# Altium schematic sheet ModuleRegulator.SchDoc: Module Regulator
size A; DocumentNumber: 4; SheetNumber: 4; SheetTotal: 22
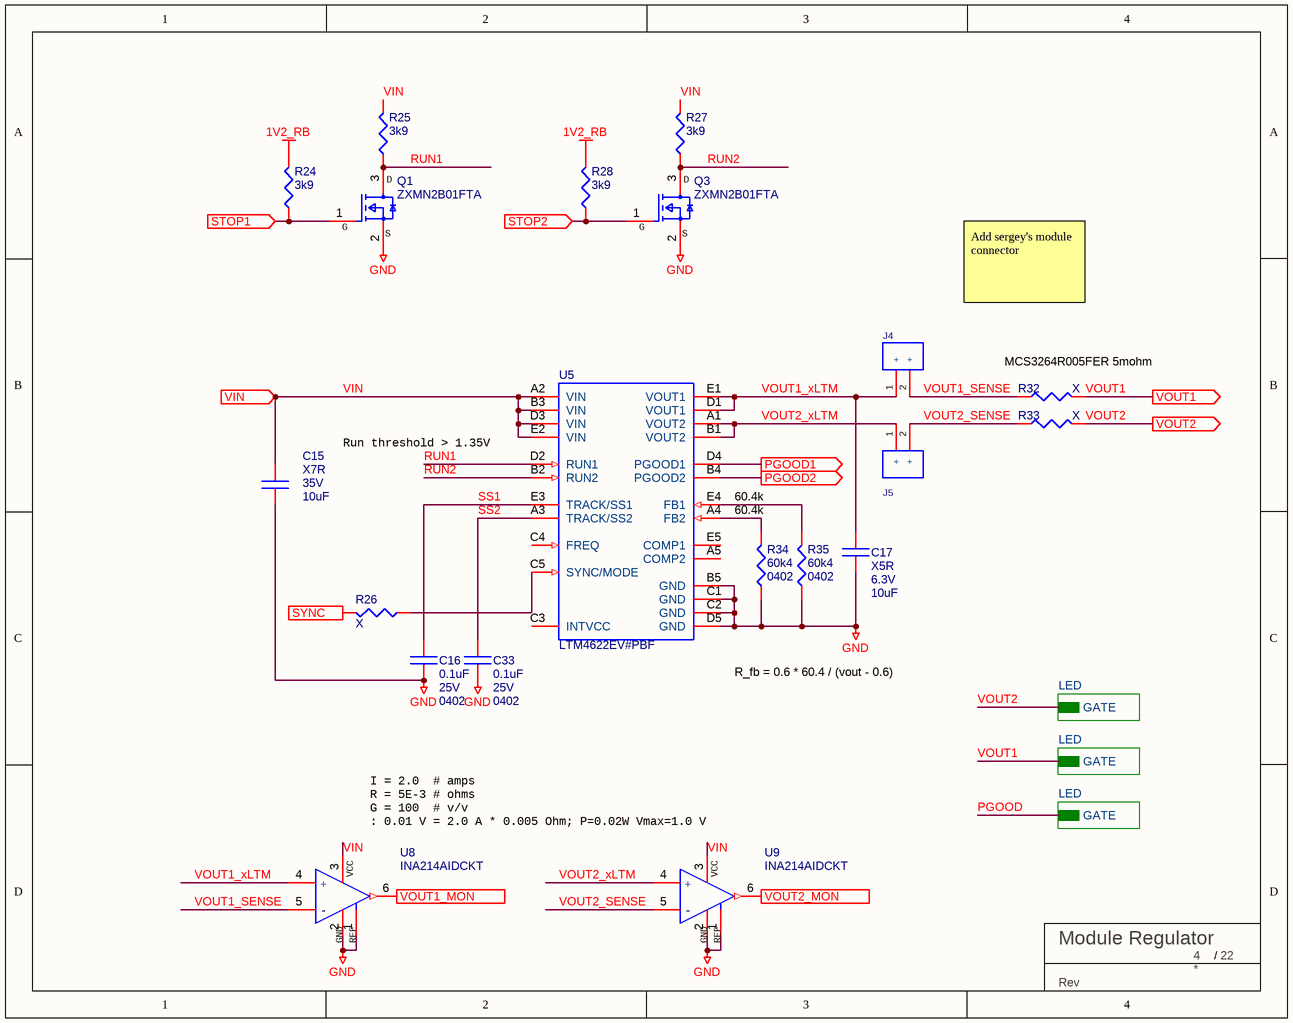
[diagram p0: ModuleRegulator.SchDoc]

## Parts
C15  TempCo: X7R  Voltage: 35V  [C_1206_IPC]  (hidden comment: 10uF)
C16  0.1uF  Voltage: 25V  Package: 0402  [C_0402_IPC_NOSILK]
C17  TempCo: X5R  Voltage: 6.3V  [C_0603_IPC]  (hidden comment: 10uF)
C33  0.1uF  Voltage: 25V  Package: 0402  [C_0402_IPC_NOSILK]
J4  HEADER 01x02  [HEADER 01x02]  (value not drawn)
J5  HEADER 01x02  [HEADER 01x02]  (value not drawn)
Q1  ZXMN2B01FTA  [SOT-23]
Q3  ZXMN2B01FTA  [SOT-23]
R24  3k9  [R_0402_IPC]
R25  3k9  [R_0402_IPC]
R26  Parameter 1: X  [resc1005n]  (hidden comment: ERJ-2GEJ201X)
R27  3k9  [R_0402_IPC]
R28  3k9  [R_0402_IPC]
R32  X  [resc1005n]
R33  X  [resc1005n]
R34  60k4  Package: 0402  [R_0402_IPC]
R35  60k4  Package: 0402  [R_0402_IPC]
TBLOCK?  BU Title block  (value not drawn)  (graphical)
U5  LTM4622EV#PBF  [LT-LGA-25-6250X6250X1820_V]
U8  INA214AIDCKT  [FP-DCK0006A-IPC_A]
U9  INA214AIDCKT  [FP-DCK0006A-IPC_A]

## Sub-sheets
LED = LED-Driver.SchDoc: GATE
LED = LED-Driver.SchDoc: GATE
LED = LED-Driver.SchDoc: GATE

## Ports
PGOOD1 (out), PGOOD2 (out), STOP1 (in), STOP2 (in), SYNC (in), VIN (in), VOUT1 (out), VOUT1_MON (out), VOUT2 (out), VOUT2_MON (out)

## Nets
1V2_RB: R24.2 R28.2
GND: C15.2 C16.1 C17.2 C33.1 Q1.2(Source) Q3.2(Source) R34.1 R35.1 U5.B5(GND) U5.C1(GND) U5.C2(GND) U5.D5(GND) U8.1(REF) U8.2(GND) U9.1(REF) U9.2(GND)
PGOOD: sheet LED/GATE
PGOOD1: U5.D4(PGOOD1) ; port PGOOD1
PGOOD2: U5.B4(PGOOD2) ; port PGOOD2
RUN1: Q1.3(Drain) R25.1 U5.D2(RUN1)
RUN2: Q3.3(Drain) R27.1 U5.B2(RUN2)
SS1: C16.2 U5.E3(TRACK/SS1)
SS2: C33.2 U5.A3(TRACK/SS2)
STOP1: Q1.1(Gate) R24.1 ; port STOP1
STOP2: Q3.1(Gate) R28.1 ; port STOP2
SYNC: R26.2 ; port SYNC
VIN: C15.1 R25.2 R27.2 U5.A2(VIN) U5.B3(VIN) U5.D3(VIN) U5.E2(VIN) U8.3(V+) U9.3(V+) ; port VIN
VOUT1: R32.2 ; port VOUT1, sheet LED/GATE
VOUT1_MON: U8.6(OUT) ; port VOUT1_MON
VOUT1_SENSE: J4.2(+) R32.1 U8.5(IN-)
VOUT1_xLTM: C17.1 J4.1(+) U5.D1(VOUT1) U5.E1(VOUT1) U8.4(IN+)
VOUT2: R33.2 ; port VOUT2, sheet LED/GATE
VOUT2_MON: U9.6(OUT) ; port VOUT2_MON
VOUT2_SENSE: J5.2(+) R33.1 U9.5(IN-)
VOUT2_xLTM: J5.1(+) U5.A1(VOUT2) U5.B1(VOUT2) U9.4(IN+)
NetR26_1: R26.1 U5.C5(SYNC/MODE)
NetR34_2: R34.2 U5.A4(FB2)
NetR35_2: R35.2 U5.E4(FB1)

Not connected (* = marked no-connect by the designer): U5 A5(COMP2) C3(INTVCC) C4(FREQ) E5(COMP1)

## Notes on the sheet
- Add sergey's module connector
- (near R32) MCS3264R005FER 5mohm
- Run threshold > 1.35V
- 60.4k
- R_fb = 0.6 * 60.4 / (vout - 0.6)
- I = 2.0  # amps
  R = 5E-3 # ohms
  G = 100  # v/v
  : 0.01 V = 2.0 A * 0.005 Ohm; P=0.02W Vmax=1.0 V
- (in symbol INA214AIDCKT) +; VCC
- (in symbol TITLE_BLOCK_BU) /; Rev
- (in symbol ZXMN2B01FTA) D; G; S

## Library data of the parts
C15 = C-CER-E6-10uF-1206-35V-X7R: CAP CER 10UF 35V X7R 1206; Supplier 1: Digi-Key; VALUE: 10uF; Supplier Part Number 1: 587-3007-1-ND
C16 C33 = C-CER-E5-0.1uF-0402-25V-X7R: GRM155R71E104ME14D; TempCo: X7R
C17 = C-CER-E6-10uF-0603-6.3V-X5R: CAP CER 10UF 6.3V X5R 0603; Supplier 1: Digi-Key; Supplier Part Number 1: 490-16349-1-ND; VALUE: 10uF
J4 J5 = HEADER 01x02: Header, 01x02, 100 mil, PTH
Q1 Q3 = ZXMN2B01FTA: MOSFET N-CH 20V 2.1A SOT-23-3; ComponentLink2Description: Datasheet; ComponentLink2URL: https://www.diodes.com/assets/Datasheets/ZXMN2B01F.pdf
R24 R25 R27 R28 = R-E3-3K9-0402-5%: RES SMD 3.9K OHM 5% 1/16W 0402
R26 = R1: FILM RESISTOR; Text Field2: 5%
R32 R33 = R: FILM RESISTOR; Text Field2: 5%; Parameter 1: X
R34 R35 = R-E3-60K4-0402-1%: RES SMD 60.4k Ohm 1% 1/16W 0402; Part Number: RC0402FR-0760K4L
TBLOCK? = TITLE_BLOCK_BU
U5 = LTM4622EV: Dual Ultrathin Step-Down DC/DC uModule Regulator, 2.5 A, 3.6 to 20 V, -40 to 125 degC, 25-Pin LGA, RoHS, Tray; Manufacturer: LinearTechnology; Manufacturer 1: Linear Technology/Analog Devices; Voltage - Input (Min): 3.6V; Voltage - Output 1: 0.6~5.5V; Package Version: Rev. 0, 06/2013; Current - Output (Max): 2.5A; Number of Outputs: 1; Voltage - Input (Max): 20V; Type: Non-IsolatedPoLModule; Power (Watts) - Max: -; Mounting Technology: SurfaceMount; Applications: ITE(Commercial); Series: µModule®; Category: PowerSupplies-BoardMount; Package Description: 25-Pin LGA, Body 6.25 x 6.25 mm, Pitch 1.27 mm; Package / Case: 25-LGA; Size / Dimension: 0.25"Lx0.25"Wx0.07"H(6.3mmx6.3mmx1.8mm); Family: DCDCConverters; Mounting Type: SurfaceMount; Datasheet Version: Rev. B, 01/2016; Manufacturer URL: http://www.linear.com/; Operating Temperature: -40°C~125°C; Efficiency: -; Voltage - Output 2: -; Power (Watts) - Manufacture Series: -; Features: OCP,OTP,OVP; Packaging: Tray; Package URL: http://www.linear.com/docs/43379; Package Reference: LGA-25; Datasheet URL: http://cds.linear.com/docs/en/datasheet/4622fb.pdf; Voltage - Isolation: -; Voltage - Output 3: -; Manufacturer Part Number 1: LTM4622EV#PBF
U8 U9 = INA214AIDCKT: IC CURR SENSE 1 CIRCUIT SC70-6; Gain Bandwidth Product: 7kHz; Number of Elements: 1; Operating Supply Current: 115uA; Input Bias Current: 35uA; Unity Gain Bandwidth Product: 14kHz; Max Supply Voltage: 26V; Input Offset Voltage (Vos): 35uV; Voltage Gain: 53.98dB; Nominal Supply Current: 65uA; Operating Supply Voltage: 24V; Accuracy: 1%; Slew Rate: 0.04V/µs; Common Mode Rejection Ratio: 105dB; Power Supply Rejection Ratio (PSRR): 140dB; Min Supply Voltage: 2.7V; Min Input Voltage: -300mV; RoHS Compliant: Yes; Number of Amplifiers: 1; Lead Free: Lead Free; Length: 2mm; Max Operating Temperature: 125°C; Max Input Voltage: 26V; Radiation Hardening: No; Min Operating Temperature: -40°C; Bandwidth: 14kHz; REACH SVHC: No SVHC; Contact Plating: Gold; Series: -; Package Quantity: 1; Number of Pins: 6; Height: 0.9mm; Mount: Surface Mount; Case/Package: SC; Number of Channels: 1; Weight: 8.8E-05oz; Width: 1.25mm; Packaging: Tape and Reel; Supply Current: 65uA